# Altium schematic sheet SheetCopied.SchDoc
size A; SheetNumber: 1; SheetTotal: 1
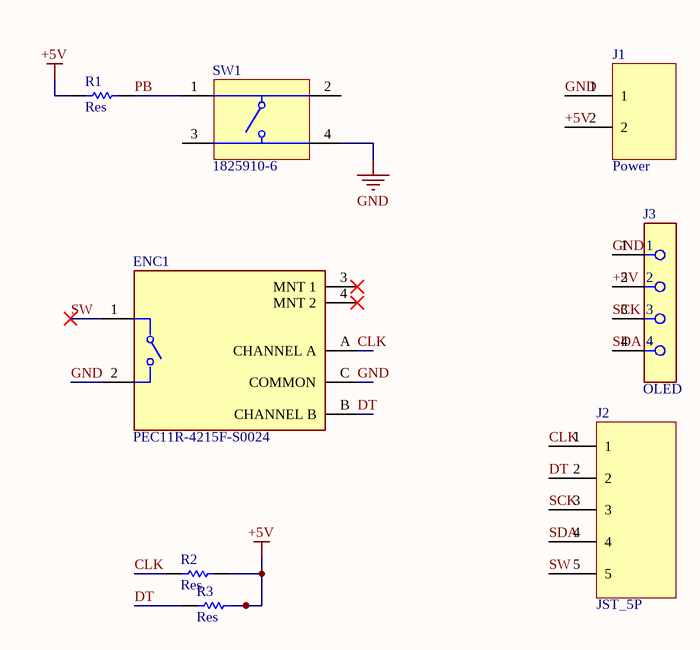
[diagram p0: SheetCopied.SchDoc]

## Parts
ENC1  PEC11R-4215F-S0024  [FP-PEC11R-4215F-S0024-MFG]
J1  Power  [JST_2P]
J2  JST_5P  [JST_5P]
J3  OLED  [FP-643416-1-MFG]
R1  Res  [RESC2013X60X40ML20T25]
R2  Res  [RESC2013X60X40ML20T25]
R3  Res  [RESC2013X60X40ML20T25]
SW1  1825910-6  [TECO-1825910-6_V]

## Nets
+5V: J1.2 J3.2 R1.1 R2.2 R3.2
GND: ENC1.2 ENC1.C(COMMON) J1.1 J3.1 SW1.4
CLK: ENC1.A(CHANNEL_A) J2.1 R2.1
DT: ENC1.B(CHANNEL_B) J2.2 R3.1
PB: R1.2 SW1.1
SCK: J2.3 J3.3
SDA: J2.4 J3.4
SW: ENC1.1 J2.5

Not connected (* = marked no-connect by the designer): ENC1 3(MNT_1)* 4(MNT_2)*; SW1 2 3

## Library data of the parts
ENC1 = CMP-1747-00012-2: ROTARY ENCODER MECHANICAL 24PPR; Hole Diameter: 1.8mm; Output Type: Quadrature; Pulses per Revolution: 24; Number of Channels: 2; Built in Switch: Yes; Min Operating Temperature: -30°C; Series: PEC11R; Type: Mechanical; Package Quantity: 150; Length: 21.5mm; Max Operating Temperature: 70°C; Encoder Type: Mechanical; Height: 13.4mm; Detent: Yes; Packaging: Bulk; Orientation: Vertical; Width: 12.5mm; Termination: PC Pins; Mount: Through Hole; REACH SVHC: No SVHC; Radiation Hardening: No; RoHS Compliant: Yes
J1 = JST_2P
J3 = CMP-03369-000025-1: CONN HDR 4POS 0.25 TIN PCB; Manufacturer Part Number: 643416-1; Manufacturer: TE; Current Rating: 12A; Voltage Rating: 600V; Number Of Contacts: 4; Standoff Height: 0.63mm; Pitch: 6.35mm; Conn Gender: Female; Conn Orientation: Vertical; Is Female: yes; Automotive: No; Octopart: https://octopart.com/643416-1-te+connectivity-39538283; Device Class L1: Connectors; Contact Material: Tin; Device Class L3: unset; Device Class L2: Headers and Wire Housings; ComponentLink2Description: Datasheet; Temperature: -40°C to +105°C; Category: Conn; Number Of Rows: 1; Package: 643416-1; Temperature Range High: +105°C; Temperature Range Low: -40°C; Digikey Description: CONN HDR 4POS 0.25 TIN PCB; Lead Free: Yes; ComponentLink2URL: https://www.te.com/usa-en/product-643416-1.html?te_bu=Cor&te_type=other&te_campaign=oct_glo_cor-oct-global-oth-prtnr-fy19-oct-octo-buy-bom_sma-298_2&elqCampaignId=35216; RoHS: TRUE; Mouser Description: Conn Power SKT 4 POS 6.35mm Solder ST Thru-Hole 4 Terminal 1 Port Bag; Height: 14.99mm
R1-R3 = CMP-2001-00629-1: Part Number: ERA6AEB332V; Manufacturer: Panasonic
SW1 = CMP-1684-00021-1: Tact Switch, SPST-NO, 0.05 A, -35 to 85 degC, 4-Pin THD, RoHS, Bulk; Manufacturer: TE Connectivity; Maximum Contact Resistance: 100mOhm; Mechanical Life: 100000Cycles; Bushing Type: Unthreaded; Switch Configuration: OFF(ON); Maximum DC Voltage Rating: 24V; Contact Rating @ Voltage: 0.05A@24VDC; Actuator Color: Black; Body Orientation: Straight; Function: MomentaryContact; Illumination: N/R; Actuator Style: RoundButton; Actuator Material: PolybutyleneTerephthalate; Dielectric Strength: 500VAC; Pole Throw Configuration: SPST; Actuator Length: 1.4mm; Product Weight: N/A; Contact Material: CopperAlloy; Housing Material: N/A; Terminal Type: PCPins; Minimum Insulation Resistance: 100MOhm; Package Description: 4-Pin Through Hole Device, Body 5.99 x 5.99 mm, Pitch 6.5 mm; Part No: 1825910-6; Package Reference: THD; Base Material: N/A; Manufacturer URL: http://www.te.com; Contact Plating: Silver; RoHS: Yes; Datasheet Version: Rev. C9; Electrical Life: 100000Cycles; Maximum AC Voltage Rating: N/A; Thread Size: N/R; Operating Temperature: -35to85C; Mounting: ThroughHole; Dimension: 5.99x5mm; Datasheet URL: http://www.te.com/commerce/DocumentDelivery/DDEController?Action=showdoc&DocId=Customer+Drawing%7F1825910%7FC9%7Fpdf%7FEnglish%7FENG_CD_1825910_C9.pdf%7F1825910-6; Family: 1825910; Seal Location: N/A; Seal Description: N/A; Packaging: N/A